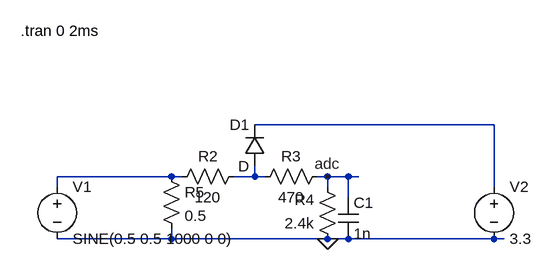
[diagram p0: schematic strom_fb.asc]
strom_fb.asc, the LTspice schematic file:
Version 4
SHEET 1 972 680
WIRE 896 256 528 256
WIRE 400 336 224 336
WIRE 416 336 400 336
WIRE 528 336 528 320
WIRE 528 336 496 336
WIRE 544 336 528 336
WIRE 640 336 624 336
WIRE 672 336 640 336
WIRE 688 336 672 336
WIRE 224 352 224 336
WIRE 640 352 640 336
WIRE 896 352 896 256
WIRE 672 368 672 336
WIRE 400 432 400 416
WIRE 400 432 224 432
WIRE 640 432 400 432
WIRE 672 432 640 432
WIRE 896 432 672 432
WIRE 912 432 896 432
FLAG 640 336 adc
FLAG 640 432 0
SYMBOL res 512 320 R90
WINDOW 0 0 56 VBottom 2
WINDOW 3 32 56 VTop 2
SYMATTR InstName R2
SYMATTR Value 120
SYMBOL res 640 320 R90
WINDOW 0 0 56 VBottom 2
WINDOW 3 32 56 VTop 2
SYMATTR InstName R3
SYMATTR Value 470
SYMBOL res 656 448 R180
WINDOW 0 36 76 Left 2
WINDOW 3 36 40 Left 2
SYMATTR InstName R4
SYMATTR Value 2.4k
SYMBOL diode 544 320 R180
WINDOW 0 24 64 Left 2
WINDOW 3 24 0 Left 2
SYMATTR InstName D1
SYMBOL voltage 224 336 R0
SYMATTR InstName V1
SYMATTR Value SINE(0.5 0.5 1000 0 0)
SYMATTR SpiceLine Rser=1
SYMBOL voltage 896 336 R0
SYMATTR InstName V2
SYMATTR Value 3.3
SYMBOL res 384 320 R0
SYMATTR InstName R5
SYMATTR Value 0.5
SYMBOL cap 656 368 R0
SYMATTR InstName C1
SYMATTR Value 1n
TEXT 168 112 Left 2 !.tran 0 2ms

The netlist it stands for:
* strom_fb.asc
R2 N003 N002 120
R3 adc N003 470
R4 0 adc 2.4k
D1 N003 N001 D
V1 N002 0 SINE(0.5 0.5 1000 0 0) Rser=1
V2 N001 0 3.3
R5 N002 0 0.5
C1 adc 0 1n
.model D D
.lib standard.dio
.tran 0 2ms
.backanno
.end